# Altium schematic sheet Power Management.SchDoc
size 594 x 420 mm; SheetNumber: 6; SheetTotal: 16; SPICEModelCacheIIFAMJZA: <root> / <DocumentId>IIFAMJZA</DocumentId> / </root>
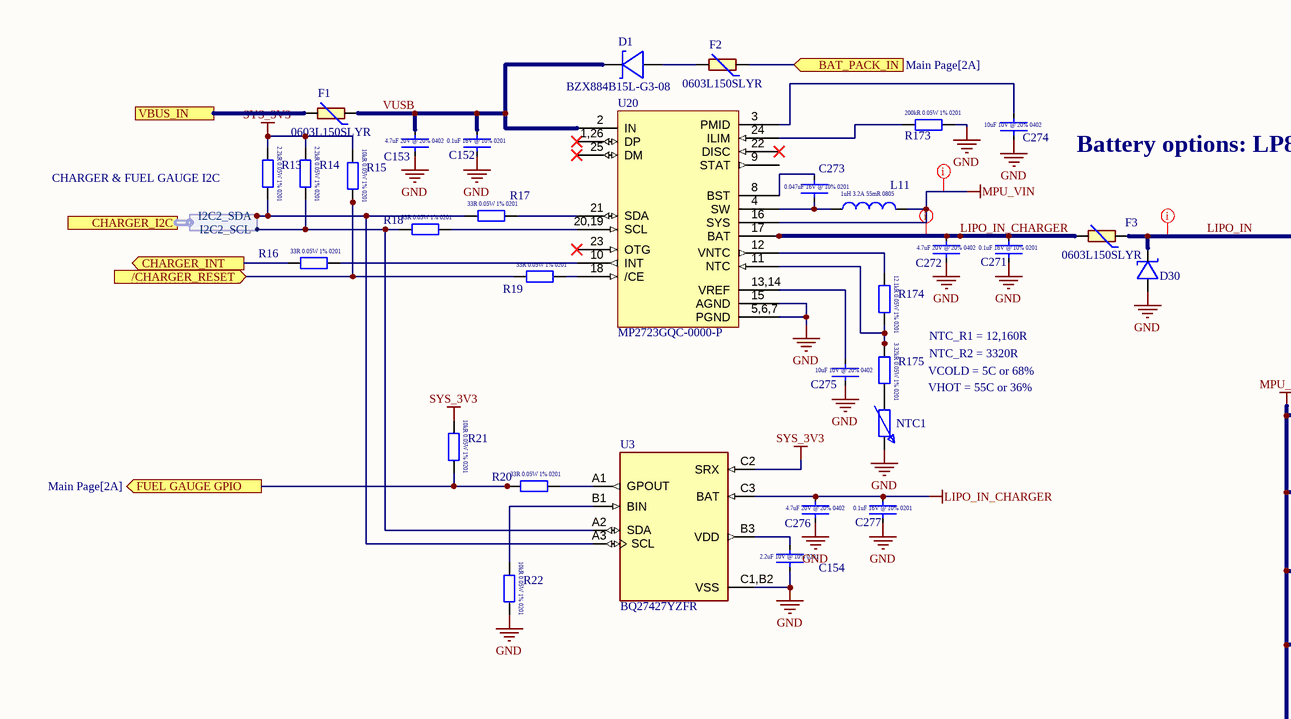
[diagram p0: Power Management.SchDoc, top left]
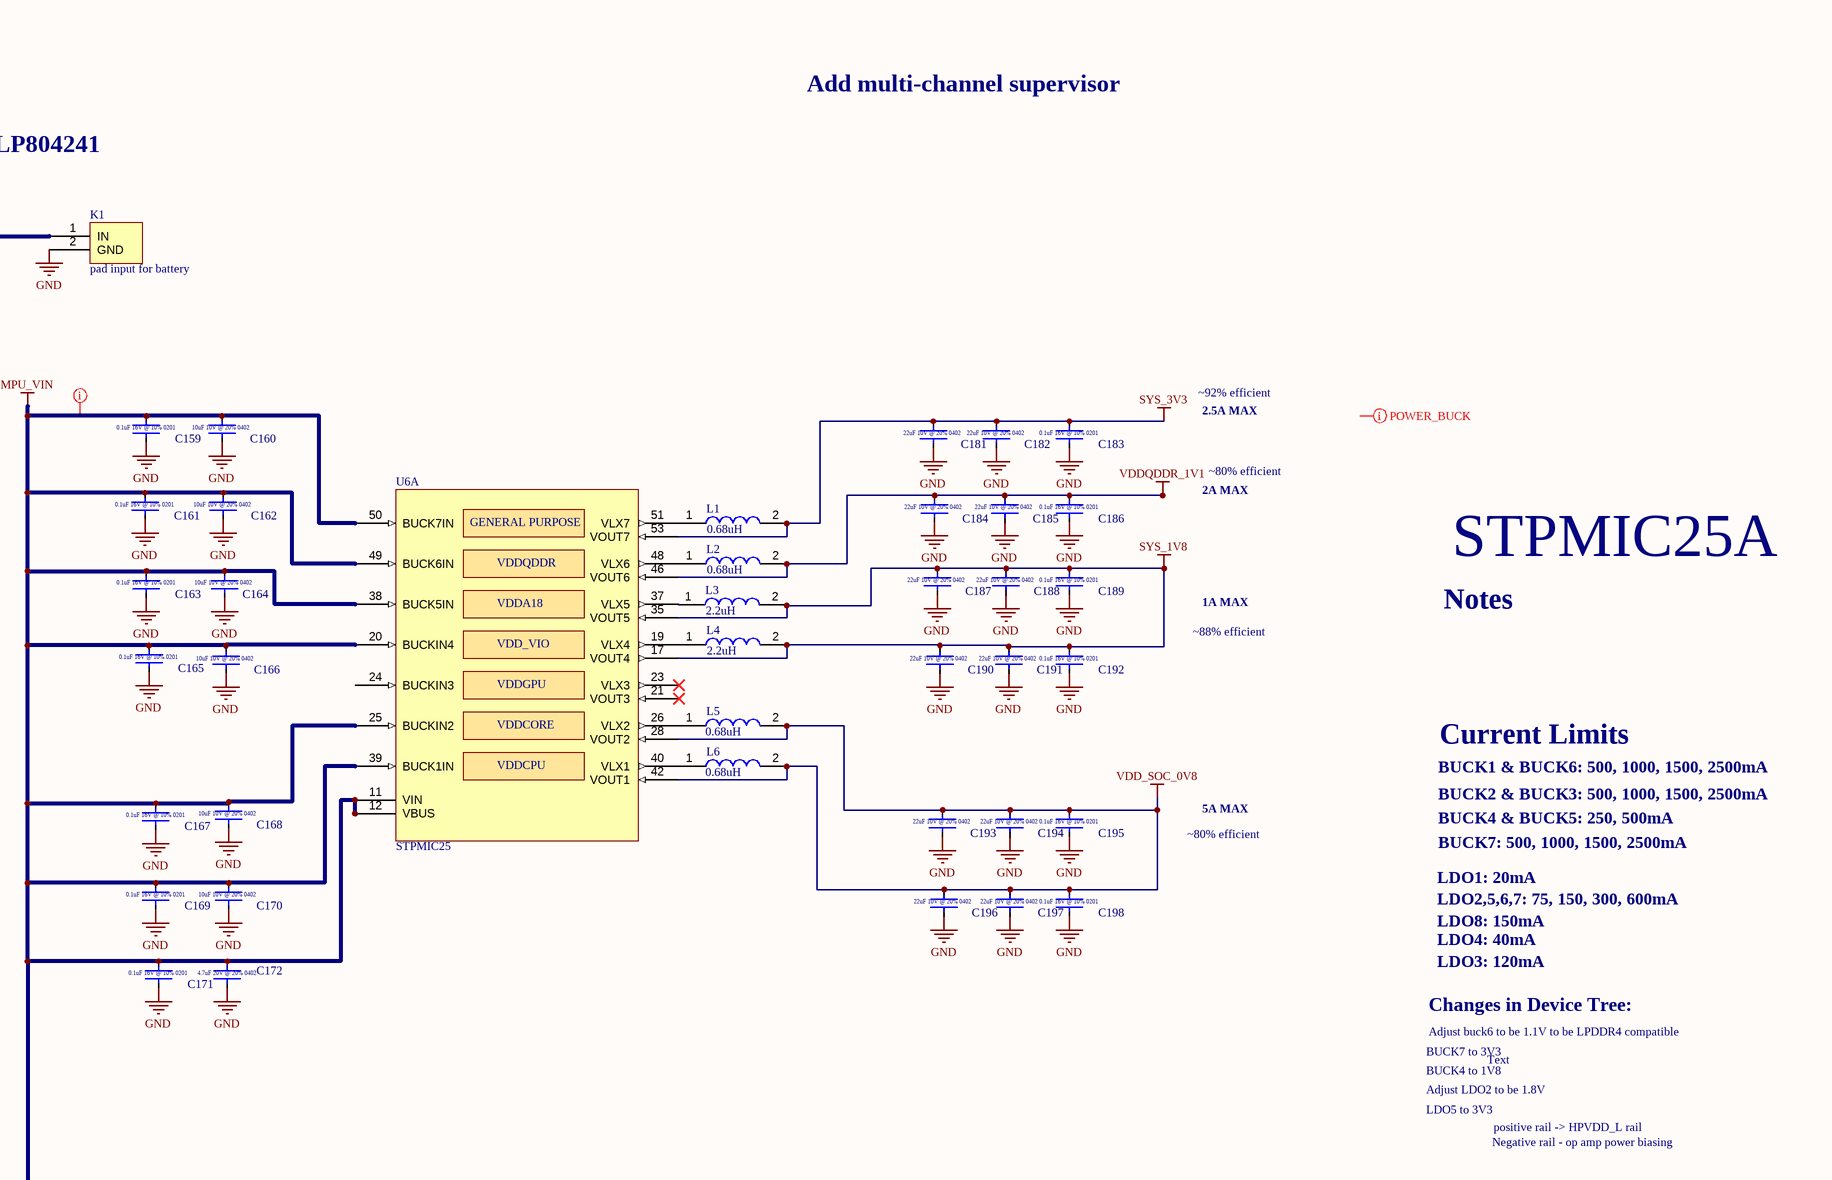
[diagram p1: Power Management.SchDoc, top right]
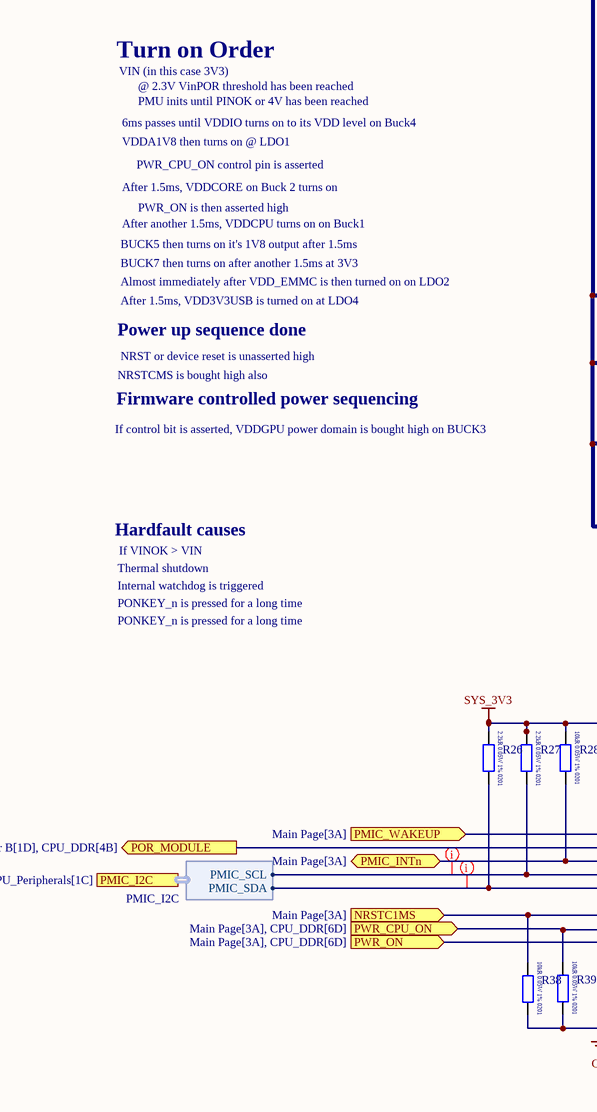
[diagram p2: Power Management.SchDoc, bottom left]
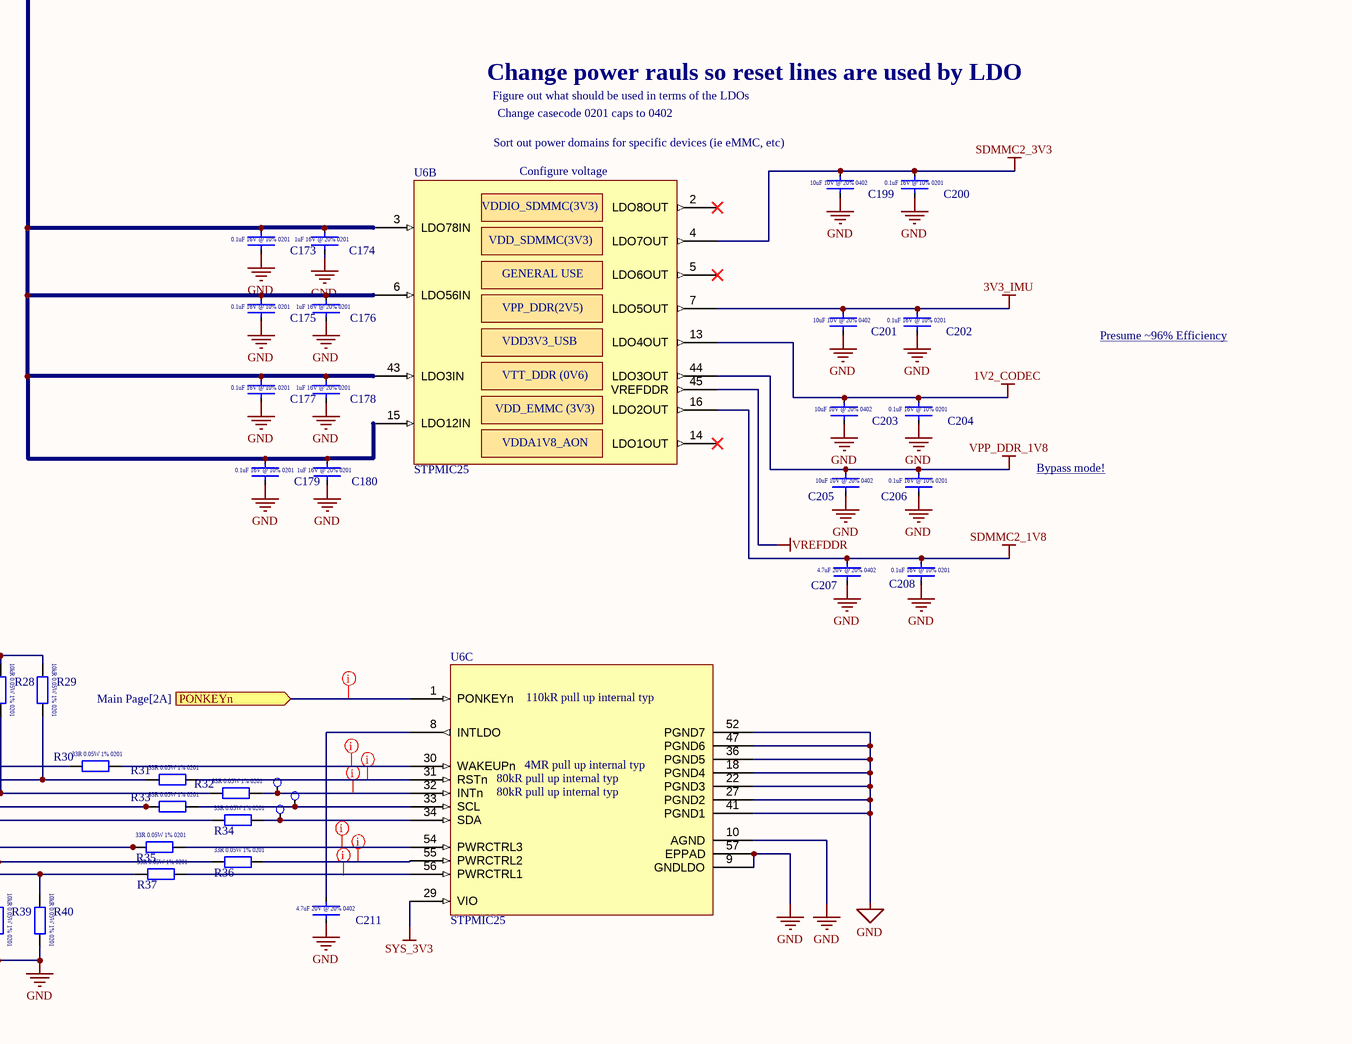
[diagram p3: Power Management.SchDoc, bottom right]

## Parts
C152  0.1uF  [CAPC0603X03L]  (value not drawn)
C153  4.7uF  [CAPC1005X06L]  (value not drawn)
C154  GRM033R61A225KE47D  [CAPC0603X03L]  (value not drawn)
C159  0.1uF  [CAPC0603X03L]  (value not drawn)
C160  GRT155R61A106ME13J  [CAPC1005X06L]  (value not drawn)
C161  0.1uF  [CAPC0603X03L]  (value not drawn)
C162  GRT155R61A106ME13J  [CAPC1005X06L]  (value not drawn)
C163  0.1uF  [CAPC0603X03L]  (value not drawn)
C164  GRT155R61A106ME13J  [CAPC1005X06L]  (value not drawn)
C165  0.1uF  [CAPC0603X03L]  (value not drawn)
C166  GRT155R61A106ME13J  [CAPC1005X06L]  (value not drawn)
C167  0.1uF  [CAPC0603X03L]  (value not drawn)
C168  GRT155R61A106ME13J  [CAPC1005X06L]  (value not drawn)
C169  0.1uF  [CAPC0603X03L]  (value not drawn)
C170  GRT155R61A106ME13J  [CAPC1005X06L]  (value not drawn)
C171  0.1uF  [CAPC0603X03L]  (value not drawn)
C172  4.7uF  [CAPC1005X06L]  (value not drawn)
C173  0.1uF  [CAPC0603X03L]  (value not drawn)
C174  GRM033R61C105ME15D  [CAPC0603X03L]  (value not drawn)
C175  0.1uF  [CAPC0603X03L]  (value not drawn)
C176  GRM033R61C105ME15D  [CAPC0603X03L]  (value not drawn)
C177  0.1uF  [CAPC0603X03L]  (value not drawn)
C178  GRM033R61C105ME15D  [CAPC0603X03L]  (value not drawn)
C179  0.1uF  [CAPC0603X03L]  (value not drawn)
C180  GRM033R61C105ME15D  [CAPC0603X03L]  (value not drawn)
C181  GRM158R61A226ME15D  [CAPC1005X06L]  (value not drawn)
C182  GRM158R61A226ME15D  [CAPC1005X06L]  (value not drawn)
C183  0.1uF  [CAPC0603X03L]  (value not drawn)
C184  GRM158R61A226ME15D  [CAPC1005X06L]  (value not drawn)
C185  GRM158R61A226ME15D  [CAPC1005X06L]  (value not drawn)
C186  0.1uF  [CAPC0603X03L]  (value not drawn)
C187  GRM158R61A226ME15D  [CAPC1005X06L]  (value not drawn)
C188  GRM158R61A226ME15D  [CAPC1005X06L]  (value not drawn)
C189  0.1uF  [CAPC0603X03L]  (value not drawn)
C190  GRM158R61A226ME15D  [CAPC1005X06L]  (value not drawn)
C191  GRM158R61A226ME15D  [CAPC1005X06L]  (value not drawn)
C192  0.1uF  [CAPC0603X03L]  (value not drawn)
C193  GRM158R61A226ME15D  [CAPC1005X06L]  (value not drawn)
C194  GRM158R61A226ME15D  [CAPC1005X06L]  (value not drawn)
C195  0.1uF  [CAPC0603X03L]  (value not drawn)
C196  GRM158R61A226ME15D  [CAPC1005X06L]  (value not drawn)
C197  GRM158R61A226ME15D  [CAPC1005X06L]  (value not drawn)
C198  0.1uF  [CAPC0603X03L]  (value not drawn)
C199  GRT155R61A106ME13J  [CAPC1005X06L]  (value not drawn)
C200  0.1uF  [CAPC0603X03L]  (value not drawn)
C201  GRT155R61A106ME13J  [CAPC1005X06L]  (value not drawn)
C202  0.1uF  [CAPC0603X03L]  (value not drawn)
C203  GRT155R61A106ME13J  [CAPC1005X06L]  (value not drawn)
C204  0.1uF  [CAPC0603X03L]  (value not drawn)
C205  GRT155R61A106ME13J  [CAPC1005X06L]  (value not drawn)
C206  0.1uF  [CAPC0603X03L]  (value not drawn)
C207  4.7uF  [CAPC1005X06L]  (value not drawn)
C208  0.1uF  [CAPC0603X03L]  (value not drawn)
C211  4.7uF  [CAPC1005X06L]  (value not drawn)
C271  0.1uF  [CAPC0603X03L]  (value not drawn)
C272  4.7uF  [CAPC1005X06L]  (value not drawn)
C273  GRT033R61C473KE01J  [CAPC0603X03L]  (value not drawn)
C274  GRM155R61A106ME11D  [CAPC1005X06L]  (value not drawn)
C275  GRM155R61A106ME11D  [CAPC1005X06L]  (value not drawn)
C276  4.7uF  [CAPC1005X06L]  (value not drawn)
C277  0.1uF  [CAPC0603X03L]  (value not drawn)
D1  BZX884B15L-G3-08  [BZX884B15L-G3-08]
D30  RCLAMP04041PW.C  [RCLAMP04041PW.C]  (value not drawn)
F1  0603L150SLYR  [FUSC1608X100N]
F2  0603L150SLYR  [FUSC1608X100N]
F3  0603L150SLYR  [FUSC1608X100N]
K1  pad input for battery  [pad power input]
L1  0.68uH  [1285ASH1R0MP2]
L2  0.68uH  [1285ASH1R0MP2]
L3  2.2uH  [1285ASH1R0MP2]
L4  2.2uH  [1285ASH1R0MP2]
L5  0.68uH  [1285ASH1R0MP2]
L6  0.68uH  [1285ASH1R0MP2]
L11  IHHP0805ZHER1R0M01  [IHHP0805ZHER1R0M01 - duplicate]  (value not drawn)
NTC1  B57540G1103F000  [B57540G1103F000]  (value not drawn)
R13  RC0201FR-072K2L  [RESC0603X03L]  (value not drawn)
R14  RC0201FR-072K2L  [RESC0603X03L]  (value not drawn)
R15  ERJ-1GNF1002C  [RESC0603X03L]  (value not drawn)
R16  ERJ-1GNF33R0C  [RESC0603X03L]  (value not drawn)
R17  ERJ-1GNF33R0C  [RESC0603X03L]  (value not drawn)
R18  ERJ-1GNF33R0C  [RESC0603X03L]  (value not drawn)
R19  ERJ-1GNF33R0C  [RESC0603X03L]  (value not drawn)
R20  ERJ-1GNF33R0C  [RESC0603X03L]  (value not drawn)
R21  ERJ-1GNF1002C  [RESC0603X03L]  (value not drawn)
R22  ERJ-1GNF1002C  [RESC0603X03L]  (value not drawn)
R26  RC0201FR-072K2L  [RESC0603X03L]  (value not drawn)
R27  RC0201FR-072K2L  [RESC0603X03L]  (value not drawn)
R28  ERJ-1GNF1002C  [RESC0603X03L]  (value not drawn)
R29  ERJ-1GNF1002C  [RESC0603X03L]  (value not drawn)
R30  ERJ-1GNF33R0C  [RESC0603X03L]  (value not drawn)
R31  ERJ-1GNF33R0C  [RESC0603X03L]  (value not drawn)
R32  ERJ-1GNF33R0C  [RESC0603X03L]  (value not drawn)
R33  ERJ-1GNF33R0C  [RESC0603X03L]  (value not drawn)
R34  ERJ-1GNF33R0C  [RESC0603X03L]  (value not drawn)
R35  ERJ-1GNF33R0C  [RESC0603X03L]  (value not drawn)
R36  ERJ-1GNF33R0C  [RESC0603X03L]  (value not drawn)
R37  ERJ-1GNF33R0C  [RESC0603X03L]  (value not drawn)
R38  ERJ-1GNF1002C  [RESC0603X03L]  (value not drawn)
R39  ERJ-1GNF1002C  [RESC0603X03L]  (value not drawn)
R40  ERJ-1GNF1002C  [RESC0603X03L]  (value not drawn)
R173  RC0201FR-07200KL  [RESC0603X03L]  (value not drawn)
R174  RK73H1HTTC1212F  [RESC0603X03L]  (value not drawn)
R175  ERJ-1GNF3321C  [RESC0603X03L]  (value not drawn)
TP30  Test Point  [Test Point]  (value not drawn)
TP31  Test Point  [Test Point]  (value not drawn)
TP32  Test Point  [Test Point]  (value not drawn)
U3  BQ27427YZFR  [BQ27427YZFR]
U6  STPMIC25  [QFN127P600-8N]  (parts A,B,C of 3)
U20  MP2723GQC-0000-P  [MP2723GQC-0000-P]

## Ports
/CHARGER_RESET (in, see Main Page[3A]), BAT_PACK_IN (in, see Main Page[2A]), CHARGER_I2C (harness CHARGER & FUEL GAUGE I2C, see Main Page[3A]), CHARGER_INT (out, see Main Page[3A]), FUEL GAUGE GPIO (out, see Main Page[2A]), NRSTC1MS (in, see Main Page[3A]), PMIC_I2C (harness PMIC_I2C, see Main Page[3A], CPU_Peripherals[1C]), PMIC_INTn (bidir, see Main Page[3A]), PMIC_WAKEUP (in, see Main Page[3A]), PONKEYn (in, see Main Page[2A]), POR_MODULE (out, see Main Page[3A], Connector B[1D], CPU_DDR[4B]), PWR_CPU_ON (in, see Main Page[3A], CPU_DDR[6D]), PWR_ON (in, see Main Page[3A], CPU_DDR[6D]), VBUS_IN (see Main Page[2A])

## Harnesses
PMIC_I2C: PMIC_SCL, PMIC_SDA
CHARGER & FUEL GAUGE I2C: I2C2_SCL, I2C2_SDA

## Nets
1V2_CODEC: C203.2 C204.2 U6.13(LDO4OUT)
3V3_IMU: C201.2 C202.2 U6.7(LDO5OUT)
GND: C152.1 C153.1 C154.1 C159.1 C160.1 C161.1 C162.1 C163.1 C164.1 C165.1 C166.1 C167.1 C168.1 C169.1 C170.1 C171.1 C172.1 C173.1 C174.1 C175.1 C176.1 C177.1 C178.1 C179.1 C180.1 C181.1 C182.1 C183.1 C184.1 C185.1 C186.1 C187.1 C188.1 C189.1 C190.1 C191.1 C192.1 C193.1 C194.1 C195.1 C196.1 C197.1 C198.1 C199.1 C200.1 C201.1 C202.1 C203.1 C204.1 C205.1 C206.1 C207.1 C208.1 C211.1 C271.1 C272.1 C274.1 C275.1 C276.1 C277.1 D30.1 K1.2(GND) NTC1.2 R22.2 R38.2 R39.2 R40.2 R173.2 U3.C1,B2(VSS) U6.9(GNDLDO) U6.10(AGND) U6.18(PGND4) U6.22(PGND3) U6.27(PGND2) U6.36(PGND5) U6.41(PGND1) U6.47(PGND6) U6.52(PGND7) U6.57(EPPAD) U20.5,6,7(PGND) U20.15(AGND)
LIPO_IN_CHARGER: C271.2 C272.2 C276.2 C277.2 F3.2 U3.C3(BAT) U20.17(BAT)
MPU_VIN: C159.2 C160.2 C161.2 C162.2 C163.2 C164.2 C165.2 C166.2 C167.2 C168.2 C169.2 C170.2 C171.2 C172.2 C173.2 C174.2 C175.2 C176.2 C177.2 C178.2 C179.2 C180.2 L11.2 U6.3(LDO78IN) U6.6(LDO56IN) U6.11(VIN) U6.12(VBUS) U6.15(LDO12IN) U6.20(BUCKIN4) U6.25(BUCKIN2) U6.38(BUCK5IN) U6.39(BUCK1IN) U6.43(LDO3IN) U6.49(BUCK6IN) U6.50(BUCK7IN) U20.16(SYS)
SDMMC2_1V8: C207.2 C208.2 U6.16(LDO2OUT)
SDMMC2_3V3: C199.2 C200.2 U6.4(LDO7OUT)
SYS_1V8: C187.2 C188.2 C189.2 C190.2 C191.2 C192.2 L3.2 L4.2 U6.17(VOUT4) U6.35(VOUT5)
SYS_3V3: C181.2 C182.2 C183.2 L1.2 R13.1 R14.1 R15.1 R21.1 R26.1 R27.1 R28.1 R29.1 U3.C2(SRX) U6.29(VIO) U6.53(VOUT7)
VDD_SOC_0V8: C193.2 C194.2 C195.2 C196.2 C197.2 C198.2 L5.2 L6.2 U6.28(VOUT2) U6.42(VOUT1)
VDDQDDR_1V1: C184.2 C185.2 C186.2 L2.2 U6.46(VOUT6)
VPP_DDR_1V8: C205.2 C206.2 U6.44(LDO3OUT)
VREFDDR: U6.45(VREFDDR)
/CHARGER_RESET: R15.2 R19.1 ; port /CHARGER_RESET
BAT_PACK_IN: F2.1 ; port BAT_PACK_IN
CHARGER_INT: R16.1 ; port CHARGER_INT
FUEL GAUGE GPIO: R20.1 R21.2 ; port FUEL GAUGE GPIO
LIPO_IN: D30.2 F3.1 K1.1(IN)
NRSTC1MS: R35.1 R38.1 ; port NRSTC1MS
PMIC_INTn: R28.2 R32.1 ; port PMIC_INTn
PMIC_WAKEUP: R30.1 ; port PMIC_WAKEUP
PONKEYn: U6.1(PONKEYn) ; port PONKEYn
POR_MODULE: R29.2 R31.1 ; port POR_MODULE
PWR_CPU_ON: R36.1 R39.1 ; port PWR_CPU_ON
PWR_ON: R37.1 R40.1 ; port PWR_ON
VBUS_IN: F1.2 ; port VBUS_IN
VUSB: C152.2 C153.2 D1.2(out) F1.1 U20.2(IN)
NetC154_2: C154.2 U3.B3(VDD)
NetC211_2: C211.2 U6.8(INTLDO)
NetC273_1: C273.1 L11.1 U20.4(SW)
NetC273_2: C273.2 U20.8(BST)
NetC274_2: C274.2 U20.3(PMID)
NetC275_2: C275.2 U20.13,14(VREF)
NetD1_1: D1.1(in) F2.2
NetL1_1: L1.1 U6.51(VLX7)
NetL2_1: L2.1 U6.48(VLX6)
NetL3_1: L3.1 U6.37(VLX5)
NetL4_1: L4.1 U6.19(VLX4)
NetL5_1: L5.1 U6.26(VLX2)
NetL6_1: L6.1 U6.40(VLX1)
NetNTC1_1: NTC1.1 R175.2
NetR13_2: R13.2 R17.1 U3.A3(SCL) ; port CHARGER_I2C.I2C2_SDA
NetR14_2: R14.2 R18.1 U3.A2(SDA) ; port CHARGER_I2C.I2C2_SCL
NetR16_2: R16.2 U20.10(INT)
NetR17_2: R17.2 U20.21(SDA)
NetR18_2: R18.2 U20.20,19(SCL)
NetR19_2: R19.2 U20.18(/CE)
NetR20_2: R20.2 U3.A1(GPOUT)
NetR22_1: R22.1 U3.B1(BIN)
NetR26_2: R26.2 R34.1 ; port PMIC_I2C.PMIC_SDA
NetR27_2: R27.2 R33.1 ; port PMIC_I2C.PMIC_SCL
NetR30_2: R30.2 U6.30(WAKEUPn)
NetR31_2: R31.2 U6.31(RSTn)
NetR32_2: R32.2 TP30.12 U6.32(INTn)
NetR33_2: R33.2 TP31.12 U6.33(SCL)
NetR34_2: R34.2 TP32.12 U6.34(SDA)
NetR35_2: R35.2 U6.54(PWRCTRL3)
NetR36_2: R36.2 U6.55(PWRCTRL2)
NetR37_2: R37.2 U6.56(PWRCTRL1)
NetR173_1: R173.1 U20.24(ILIM)
NetR174_1: R174.1 U20.12(VNTC)
NetR174_2: R174.2 R175.1 U20.11(NTC)

Not connected (* = marked no-connect by the designer): U6 2(LDO8OUT)* 5(LDO6OUT)* 14(LDO1OUT)* 21(VOUT3)* 23(VLX3)* 24(BUCKIN3); U20 1,26(DP)* 9(STAT) 22(DISC)* 23(OTG)* 25(DM)*

## Layout directives
net class Power Buck: (no net found under the mark)
net class I2C_PWR: NetR26_2, NetR27_2
net class PMIC_CTRL: (no net found under the mark), NetR30_2, NetR31_2, NetR32_2, NetR36_2, PONKEYn
net class BAT_PACK_CHARGE_IN: LIPO_IN, LIPO_IN_CHARGER, MPU_VIN
net class PMIC_BUCK: MPU_VIN

## Notes on the sheet
- Add multi-channel supervisor
- Battery options: LP804241
- NTC_R1 = 12,160R
- NTC_R2 = 3320R
- VCOLD = 5C or 68%
- VHOT = 55C or 36%
- ~92% efficient
- 2.5A MAX
- 2A MAX
- ~80% efficient
- STPMIC25A
- ~88% efficient
- 1A MAX
- Notes
- BUCK1 & BUCK6: 500, 1000, 1500, 2500mA
- Current Limits
- 5A MAX
- BUCK2 & BUCK3: 500, 1000, 1500, 2500mA
- BUCK4 & BUCK5: 250, 500mA
- LDO1: 20mA
- LDO2,5,6,7: 75, 150, 300, 600mA
- BUCK7: 500, 1000, 1500, 2500mA
- LDO8: 150mA
- LDO4: 40mA
- LDO3: 120mA
- Changes in Device Tree:
- Adjust buck6 to be 1.1V to be LPDDR4 compatible
- Adjust LDO2 to be 1.8V
- BUCK7 to 3V3
- BUCK4 to 1V8
- LDO5 to 3V3
- Text
- Turn on Order
- VIN (in this case 3V3)
- @ 2.3V VinPOR threshold has been reached
- Negative rail - op amp power biasing
- positive rail -> HPVDD_L rail
- 6ms passes until VDDIO turns on to its VDD level on Buck4
- VDDA1V8 then turns on @ LDO1
- PWR_CPU_ON control pin is asserted
- PMU inits until PINOK or 4V has been reached
- Change power rauls so reset lines are used by LDO
- Figure out what should be used in terms of the LDOs
- After 1.5ms, VDDCORE on Buck 2 turns on
- After another 1.5ms, VDDCPU turns on on Buck1
- PWR_ON is then asserted high
- (near C199) Sort out power domains for specific devices (ie eMMC, etc)
- Change casecode 0201 caps to 0402
- BUCK5 then turns on it's 1V8 output after 1.5ms
- BUCK7 then turns on after another 1.5ms at 3V3
- Almost immediately after VDD_EMMC is then turned on on LDO2
- (near U6) Configure voltage
- Power up sequence done
- After 1.5ms, VDD3V3USB is turned on at LDO4
- NRST or device reset is unasserted high
- If control bit is asserted, VDDGPU power domain is bought high on BUCK3
- Firmware controlled power sequencing
- NRSTCMS is bought high also
- Presume ~96% Efficiency
- Hardfault causes
- Thermal shutdown
- If VINOK > VIN
- Bypass mode!
- Internal watchdog is triggered
- PONKEY_n is pressed for a long time
- (near U6) 110kR pull up internal typ
- (near U6) 4MR pull up internal typ
- (near U6) 80kR pull up internal typ
- DWG NO:
- REV:
- THIS DOCUMENT AND THE DATA DISCLOSED HEREIN OR
- HEREWITH IS THE PROPERTY OF ALTIUM LIMITED AND MAY
- BE FREELY DISTRIBUTED IN WHOLE. NO RIGHTS ARE
- RESERVED OR EXPRESS OR IMPLIED WARANTEE GIVEN.
- REVISION
- DESCRIPTION
- DATE
- APPROVED
- ENG:
- APPROVALS
- PROJECT
- DSN:
- CHK:
- REFERENCE DOCUMENTS
- PROJECT REVISION:
- TITLE
- DOCUMENT REVISION:
- DESIGN ITEM:
- BOM:
- FAB DWG:
- PCB DWG:
- ASSY DWG:
- SCALE:
- A2
- SIZE
- CAGE CODE
- FILE NAME
- DWG NO.
- SHEET
- OF
- REV
- (in symbol CL05A475MO5NUNC) 4.7uF 20V @ 20% 0402
- (in symbol ERJ-1GNF33R0C) 33R 0.05W 1% 0201
- (in symbol ERJ-1GNF1002C) 10kR 0.05W 1% 0201
- (in symbol ERJ-1GNF3321C) 3.32kR 0.05W 1% 0201
- (in symbol GRM033R61A225KE47D) 2.2uF 10V @ 10% 0201
- (in symbol GRM033R61C105ME15D) 1uF 16V @ 20% 0201
- (in symbol GRM033R61E104KE14J) 0.1uF 16V @ 10% 0201
- (in symbol GRM155R61A106ME11D) 10uF 10V @ 20% 0402
- (in symbol GRM158R61A226ME15D) 22uF 10V @ 20% 0402
- (in symbol GRT033R61C473KE01J) 0.047uF 16V @ 10% 0201
- (in symbol GRT155R61A106ME13J) 10uF 10V @ 20% 0402
- (in symbol IHHP0805ZHER1R0M01) 1uH 3.2A 55mR 0805
- (in symbol RC0201FR-072K2L) 2.2kR 0.05W 1% 0201
- (in symbol RC0201FR-07200KL) 200kR 0.05W 1% 0201
- (in symbol RK73H1HTTC1212F) 12.1kR 0.05W 1% 0201
- (in symbol STPMIC25, part A) GENERAL PURPOSE; VDDQDDR; VDDA18; VDD_VIO; VDDGPU; VDDCORE; VDDCPU
- (in symbol STPMIC25, part B) VDDIO_SDMMC(3V3); VDD_SDMMC(3V3); GENERAL USE; VPP_DDR(2V5); VDD3V3_USB; VTT_DDR (0V6); VDD_EMMC (3V3); VDDA1V8_AON

## Library data of the parts
C152 C159 C161 C163 C165 C167 C169 C171 C173 C175 C177 C179 C183 C186 C189 C192 C195 C198 C200 C202 C204 C206 C208 C271 C277 = GRM033R61E104KE14J: 0.1 µF ±10% 25V Ceramic Capacitor X5R 0201 (0603 Metric)0.1 µF ±10% 25V Ceramic Capacitor X5R 0201 (0603 Metric); ComponentLink1Description: New link; ComponentLink1URL: https://www.digikey.com.au/en/products/detail/murata-electronics/GRM033R61E104KE14J/4904732?s=N4IgTCBcDaIOICUCyAGAzGhA2AjAURxQBYBpAogKRAF0BfIA
C153 C172 C207 C211 C272 C276 = CL05A475MO5NUNC: 4.7 µF ±20% 16V Ceramic Capacitor X5R 0402 (1005 Metric)
C154 = GRM033R61A225KE47D: 2.2 µF ±10% 10V Ceramic Capacitor X5R 0201 (0603 Metric); ComponentLink1Description: New link; ComponentLink1URL: https://www.digikey.com.au/en/products/detail/murata-electronics/GRM033R61A225KE47D/5877390
C160 C162 C164 C166 C168 C170 C199 C201 C203 C205 = GRT155R61A106ME13J: 10 µF ±20% 10V Ceramic Capacitor X5R 0402 (1005 Metric); ComponentLink1Description: New link; ComponentLink1URL: https://www.digikey.com.au/en/products/detail/murata-electronics/GRT155R61A106ME13J/19115510
C174 C176 C178 C180 = GRM033R61C105ME15D: 1 µF ±20% 16V Ceramic Capacitor X5R 0201 (0603 Metric); ComponentLink1Description: New link; ComponentLink1URL: https://www.digikey.com.au/en/products/detail/murata-electronics/GRM033R61C105ME15D/10326307
C181 C182 C184 C185 C187 C188 C190 C191 C193 C194 C196 C197 = GRM158R61A226ME15D: 22uH 0402; ComponentLink1Description: New link; ComponentLink1URL: https://www.digikey.com.au/en/products/detail/murata-electronics/GRM158R61A226ME15D/16033379
C273 = GRT033R61C473KE01J: 0.047 µF ±10% 16V Ceramic Capacitor X5R 0201 (0603 Metric); Supplier 1: DigiKey; Supplier Part Number 1: 490-GRT033R61C473KE01JCT-ND
C274 C275 = GRM155R61A106ME11D: 10 µF ±20% 10V Ceramic Capacitor X5R 0402 (1005 Metric); Supplier 1: Arrow Electronics; Supplier Part Number 1: GRM155R61A106ME11D
D1 = BZX884B15L-G3-08: Zener Diode 15 V 300 mW ±2% Surface Mount DFN1006-2A; ComponentLink1Description: New link; ComponentLink1URL: https://www.digikey.com.au/en/products/detail/vishay-general-semiconductor-diodes-division/BZX884B15L-G3-08/14312748
D30 = RCLAMP04041PW.C: 8V Clamp 20A (8/20µs) Ipp Tvs Diode Surface Mount 2-DFN (1x0.6); ComponentLink1Description: New link; ComponentLink1URL: https://www.digikey.com.au/en/products/detail/semtech-corporation/RCLAMP04041PW-C/21379403
F1-F3 = 0603L150SLYR: Polymeric PTC Resettable Fuse 6V 1.5 A Ih Surface Mount 0603 (1608 Metric), Concave; MF: Littelfuse Inc.; SnapEDA_Link: https://www.snapeda.com/parts/0603L150SLYR/Littelfuse/view-part/?ref=snap; Package: 0603-2 LITTELFUSE; Value: *; MP: 0603L150SLYR; Check_prices: https://www.snapeda.com/parts/0603L150SLYR/Littelfuse/view-part/?ref=eda; ComponentLink1Description: New link; ComponentLink1URL: https://www.digikey.com.au/en/products/detail/littelfuse-inc/0603L150SLYR/3429591
K1 = pad input for battery: PAD on PCB representing power input for embedded LiPo battery.
L1 L2 L5 L6 = DFE201610E-R68M=P2: DFE201610E-R68M=P; Manufacturer_Name: Murata Electronics; Datasheet Link: https://search.murata.co.jp/Ceramy/image/img/P02/J(E)TE243A-0001.pdf; Height: 1mm; Manufacturer_Part_Number: DFE201610E-R68M=P2; Mouser Part Number: 81-DFE201610E-R68MP2; Mouser Price/Stock: https://www.mouser.co.uk/ProductDetail/Murata-Electronics/DFE201610E-R68M%3dP2?qs=AQlKX63v8RudjlTUxbAxDg%3D%3D; Arrow Part Number: DFE201610E-R68M=P2; Arrow Price/Stock: https://www.arrow.com/en/products/dfe201610e-r68mp2/murata-manufacturing?region=nac
L3 L4 = DFE201610E-2R2M=P2: Inductor; Manufacturer_Name: Murata Electronics; Datasheet Link: https://search.murata.co.jp/Ceramy/image/img/P02/J(E)TE243A-0001.pdf; Height: 1mm; Manufacturer_Part_Number: DFE201610E-2R2M=P2; Mouser Part Number: 81-DFE201610E-2R2MP2; Mouser Price/Stock: https://www.mouser.co.uk/ProductDetail/Murata-Electronics/DFE201610E-2R2M%3dP2?qs=AQlKX63v8Rv49b3hcvXgWQ%3D%3D; Arrow Part Number: DFE201610E-2R2M=P2; Arrow Price/Stock: https://www.arrow.com/en/products/dfe201610e-2r2mp2/murata-manufacturing?utm_currency=USD&region=nac
L11 = IHHP0805ZHER1R0M01: 1 µH Shielded Inductor 3.2 A 55mOhm Max 0805 (2012 Metric); Supplier 1: DigiKey; Supplier Part Number 1: 541-IHHP0805ZHER1R0M01CT-ND
NTC1 = B57540G1103F000: NTC Thermistor 10k Bead, Glass; Supplier 1: DigiKey; Supplier Part Number 1: 495-5054-ND
R13 R14 R26 R27 = RC0201FR-072K2L: 2.2 kOhms ±1% 0.05W, 1/20W Chip Resistor 0201 (0603 Metric) Moisture Resistant Thick Film
R15 R21 R22 R28 R29 R38-R40 = ERJ-1GNF1002C: 10 kOhms ±1% 0.05W, 1/20W Chip Resistor 0201 (0603 Metric) Thick Film; ComponentLink1Description: New link; ComponentLink1URL: https://www.digikey.com.au/en/products/detail/panasonic-electronic-components/ERJ-1GNF1002C/2036226
R16-R20 R30-R37 = ERJ-1GNF33R0C: 33 Ohms ±1% 0.05W, 1/20W Chip Resistor 0201 (0603 Metric) Thick Film; ComponentLink1Description: New link; ComponentLink1URL: https://www.digikey.com.au/en/products/detail/panasonic-electronic-components/ERJ-1GNF33R0C/2035941
R173 = RC0201FR-07200KL: 200 kOhms ±1% 0.05W, 1/20W Chip Resistor 0201 (0603 Metric) Moisture Resistant Thick Film; Supplier 1: DigiKey; Supplier Part Number 1: YAG2275CT-ND
R174 = RK73H1HTTC1212F: 12.1 kOhms ±1% 0.05W, 1/20W Chip Resistor 0201 (0603 Metric) Automotive AEC-Q200 Thick Film; Supplier 1: DigiKey; Supplier Part Number 1: 2019-RK73H1HTTC1212FCT-ND
R175 = ERJ-1GNF3321C: 3.32 kOhms ±1% 0.05W, 1/20W Chip Resistor 0201 (0603 Metric) Thick Film; Supplier 1: Arrow Electronics; Supplier Part Number 1: ERJ-1GNF3321C
U3 = BQ27427YZFR: Single-cell battery fuel gauge with pre-programmed chemistry and integrated sense resistor; MF: Texas Instruments; SnapEDA_Link: https://www.snapeda.com/parts/BQ27427YZFR/Texas+Instruments/view-part/?ref=snap; Package: None; Value: *; MP: BQ27427YZFR; Check_prices: https://www.snapeda.com/parts/BQ27427YZFR/Texas+Instruments/view-part/?ref=eda
U20 = MP2723GQC-0000-P: 3A, I2C-Controlled SW Charger with NVDC Power Path and USB OTG